# EAGLE design Motores (EAGLE 6.1)
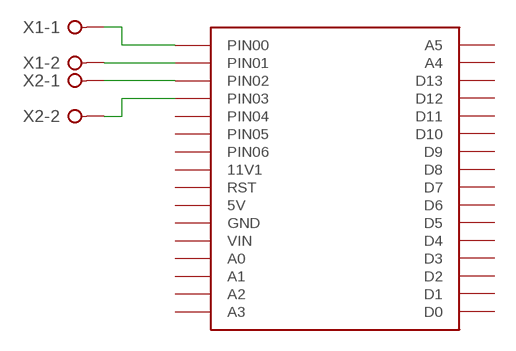
[diagram p0: schematic, sheet 1]

## Parts
U$1  BASE-FINAL  [BASE-FINAL]
X1  W237-02P  [W237-132]
X2  W237-02P  [W237-132]

## Nets
N$1: U$1.PIN01 X1.2
N$2: U$1.PIN02 X2.1
N$3: U$1.PIN03 X2.2
N$4: U$1.PIN00 X1.1
Unconnected: U$1.0(D0) U$1.1(D1) U$1.2(D2) U$1.3(D3) U$1.4(D4) U$1.5(D5) U$1.5V U$1.6(D6) U$1.7(D7) U$1.8(D8) U$1.9(D9) U$1.10(D10) U$1.11(D11) U$1.12(D12) U$1.12V(11V1) U$1.13(D13) U$1.A0 U$1.A1 U$1.A2 U$1.A3 U$1.A4 U$1.A5 U$1.GND U$1.PIN04 U$1.PIN05 U$1.PIN06 U$1.RST U$1.VIN

## Library data of the parts
U$1 = aasanchez:BASE-FINAL
X1 X2 = con-wago-508:W237-02P: WAGO SREW CLAMP; OC_FARNELL: unknown; OC_NEWARK: unknown

## Board
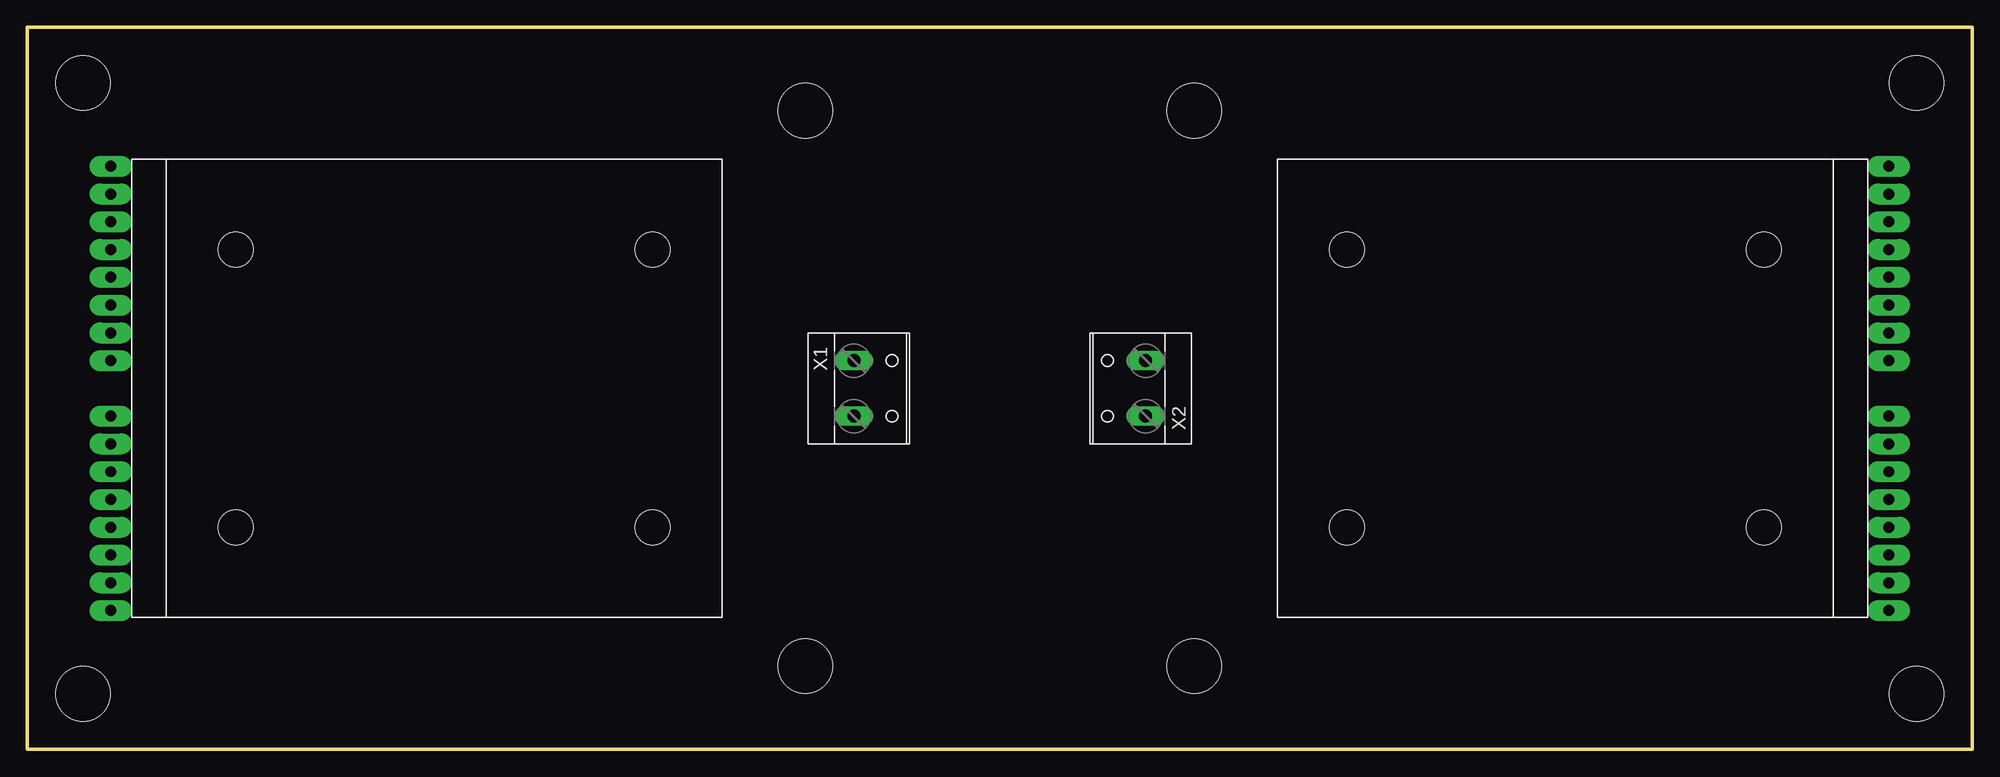
[diagram p1: board, top side]
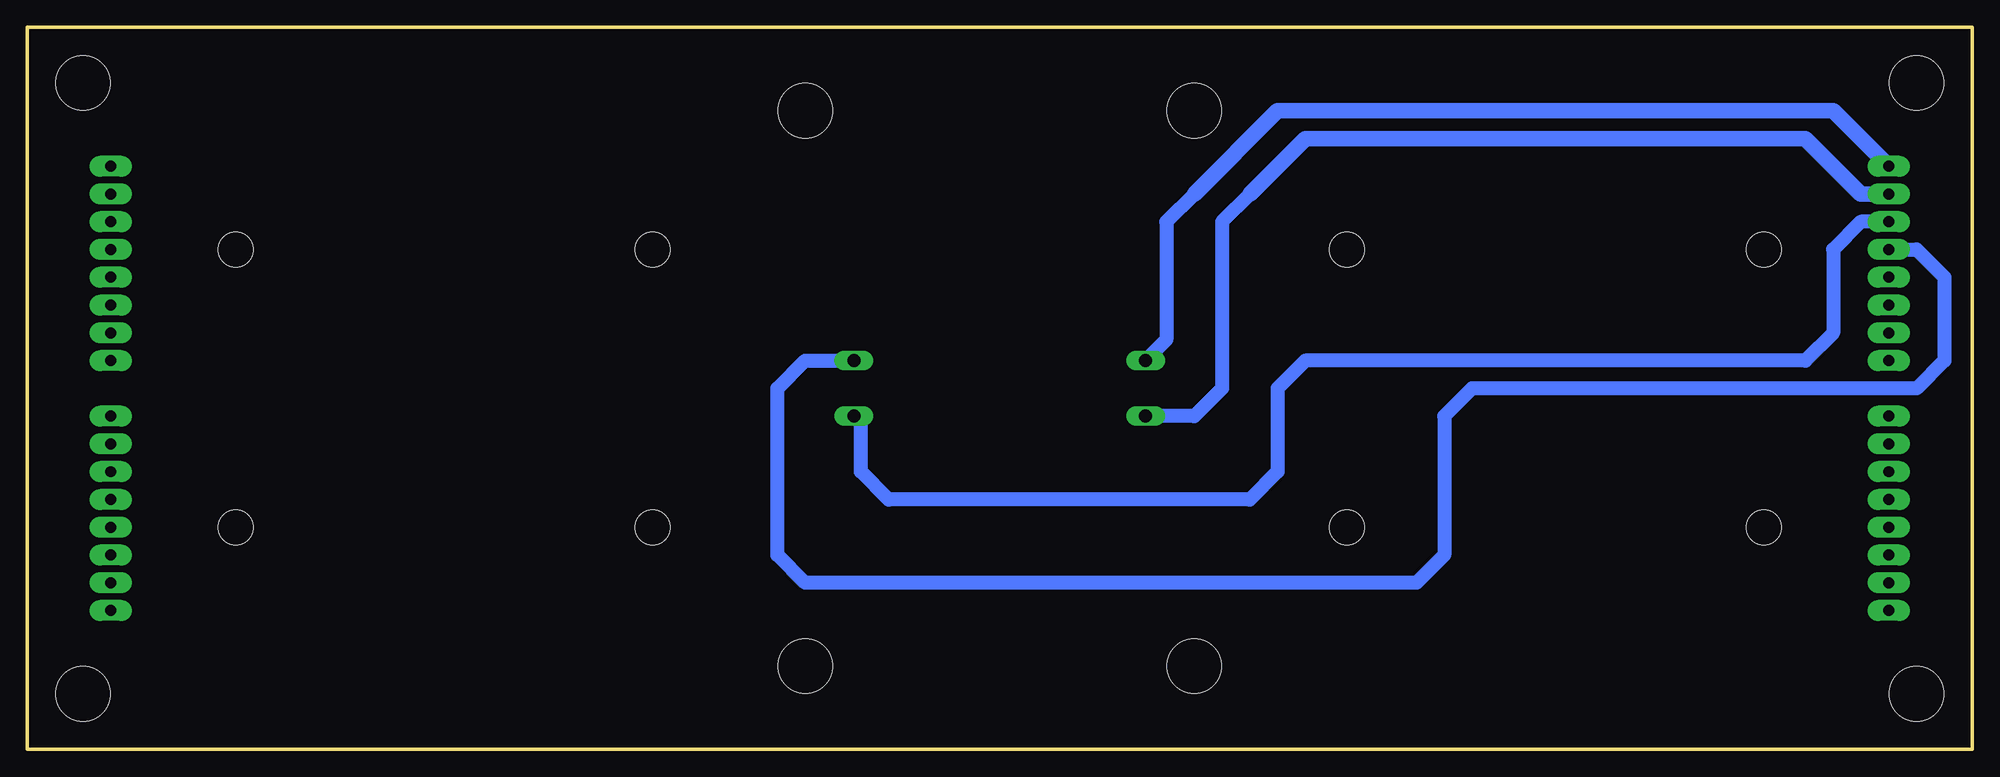
[diagram p2: board, bottom side, seen from below]

Size 177.8 x 66.04 mm. Coordinates in mm from the lower left corner, seen from the top.
Copper layers (1*16): Top 0.035mm / dielectric 1.5mm / Bottom 0.035mm
Design rules: minimum track width 10mil, minimum drill 24mil, track to track 8mil, track to pad 8mil, pad to pad 8mil, via to via 8mil, smd to smd 8mil, copper to edge 40mil, drill to drill 8mil, minimum pad ring 10mil, minimum via ring 8mil, stop-mask expansion 4mil, vias tented up to drill 0mil, thermal gap 10mil
Holes 5 mm at 71.12,58.42 106.68,58.42 106.68,7.62 71.12,7.62

### Footprints (pad centres in the part's own frame; a part is rotated, then mirrored left to right if it is on the bottom)
BASE-FINAL = drill 1 pad 1.93 long: 0 81.28,-20.32; 1 81.28,-17.78; 2 81.28,-15.24; 3 81.28,-12.7; 4 81.28,-10.16; 5 81.28,-7.62; 5V -81.28,-5.08; 6 81.28,-5.08; 7 81.28,-2.54; 8 81.28,2.54; 9 81.28,5.08; 10 81.28,7.62; 11 81.28,10.16; 12 81.28,12.7; 12V -81.28,2.54; 13 81.28,15.24; A0 -81.28,-12.7; A1 -81.28,-15.24; A2 -81.28,-17.78; A3 -81.28,-20.32; A4 81.28,17.78; A5 81.28,20.32; GND -81.28,-7.62; PIN00 -81.28,20.32; PIN01 -81.28,17.78; PIN02 -81.28,15.24; PIN03 -81.28,12.7; PIN04 -81.28,10.16; PIN05 -81.28,7.62; PIN06 -81.28,5.08; RST -81.28,-2.54; VIN -81.28,-10.16 | hole 5: -83.82,27.94; -83.82,-27.94; 83.82,-27.94; 83.82,27.94
BASEMOTOR = hole 3.2: -19.05,-12.7; 19.05,-12.7; 19.05,12.7; -19.05,12.7
W237-132 = drill 1.194 long: 1 -2.54,-0.635; 2 2.54,-0.635

### Placement (x,y rotation side)
U$1  88.9,33.02 0 top
U$2  [BASEMOTOR]  38.1,33.02 180 top
U$3  [BASEMOTOR]  139.7,33.02 0 top
X1  76.2,33.02 270 top
X2  101.6,33.02 90 top

### Tracks (layer width: path | path; a pad name or v marks a point on that pad's centre or on a via)
N$1
  Bottom 1.27: 66.04,50.8 68.58,48.26 68.58,33.02 71.12,30.48 X1.2
  Bottom 1.422: 66.04,50.8 60.96,55.88 15.24,55.88 10.16,50.8 U$1.PIN01
N$2
  Bottom 1.27: U$1.PIN02 10.16,48.26 12.7,45.72 12.7,38.1 15.24,35.56 60.96,35.56 63.5,33.02 63.5,25.4 66.04,22.86 99.06,22.86 101.6,25.4 101.6,29.84 X2.1
N$3
  Bottom 1.27: U$1.PIN03 5.08,45.72 2.54,43.18 2.54,35.56 5.08,33.02 45.72,33.02 48.26,30.48 48.26,17.78 50.8,15.24 106.68,15.24 109.22,17.78 109.22,33.02 106.68,35.56 X2.2
N$4
  Bottom 1.27: 71.12,50.8 73.66,48.26 73.66,37.47 X1.1
  Bottom 1.422: U$1.PIN00 12.7,58.42 63.5,58.42 71.12,50.8